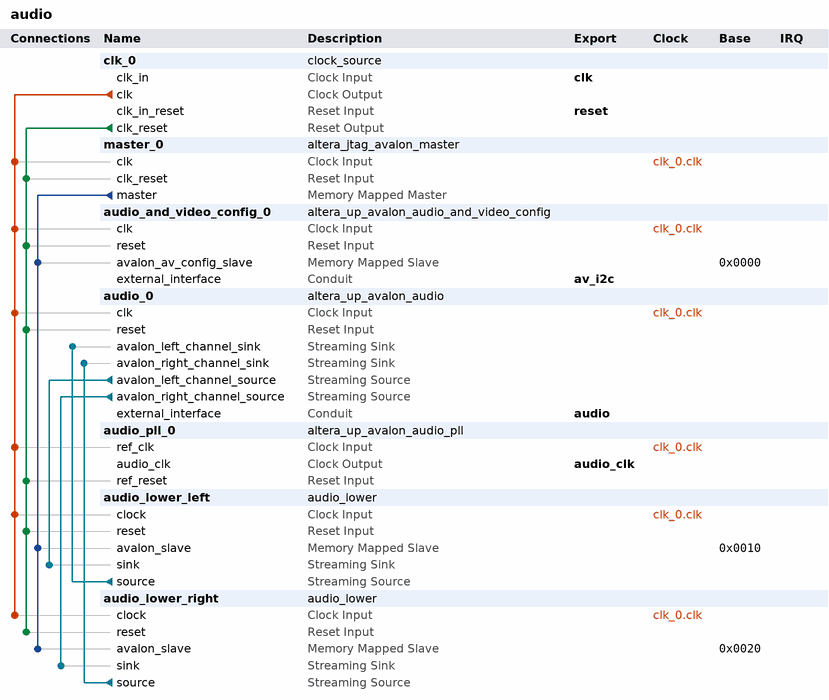
[diagram p0: system contents]
# Platform Designer (Qsys) system audio, Cyclone V 5CSEMA5F31C6
# Parameters at their usual value, and those the tool derives, are not listed.
package require -exact qsys 18.0
create_system audio
set_project_property DEVICE_FAMILY {Cyclone V}
set_project_property DEVICE 5CSEMA5F31C6

add_instance clk_0 clock_source 19.1
set_instance_parameter_value clk_0 clockFrequency 50000000

add_instance master_0 altera_jtag_avalon_master 19.1

add_instance audio_and_video_config_0 altera_up_avalon_audio_and_video_config 18.0
set_instance_parameter_value audio_and_video_config_0 audio_in {Line In to ADC}
set_instance_parameter_value audio_and_video_config_0 bit_length 24
set_instance_parameter_value audio_and_video_config_0 board DE10-Standard
set_instance_parameter_value audio_and_video_config_0 line_in_bypass false
set_instance_parameter_value audio_and_video_config_0 sampling_rate {48 kHz}
set_instance_parameter_value audio_and_video_config_0 video_format PAL

add_instance audio_0 altera_up_avalon_audio 18.0
set_instance_parameter_value audio_0 audio_in true
set_instance_parameter_value audio_0 avalon_bus_type Streaming
set_instance_parameter_value audio_0 dw 24

add_instance audio_pll_0 altera_up_avalon_audio_pll 18.0
set_instance_parameter_value audio_pll_0 gui_refclk 50.0

add_instance audio_lower_left audio_lower 1.0
set_instance_parameter_value audio_lower_left BITS 24

add_instance audio_lower_right audio_lower 1.0
set_instance_parameter_value audio_lower_right BITS 24

# connections
add_connection clk_0.clk audio_0.clk clock
add_connection clk_0.clk audio_and_video_config_0.clk clock
add_connection clk_0.clk audio_lower_left.clock clock
add_connection clk_0.clk audio_lower_right.clock clock
add_connection clk_0.clk audio_pll_0.ref_clk clock
add_connection clk_0.clk master_0.clk clock
add_connection clk_0.clk_reset audio_0.reset reset
add_connection clk_0.clk_reset audio_and_video_config_0.reset reset
add_connection clk_0.clk_reset audio_lower_left.reset reset
add_connection clk_0.clk_reset audio_lower_right.reset reset
add_connection clk_0.clk_reset audio_pll_0.ref_reset reset
add_connection clk_0.clk_reset master_0.clk_reset reset
add_connection master_0.master audio_and_video_config_0.avalon_av_config_slave avalon
set_connection_parameter_value master_0.master/audio_and_video_config_0.avalon_av_config_slave baseAddress 0x0000
add_connection master_0.master audio_lower_left.avalon_slave avalon
set_connection_parameter_value master_0.master/audio_lower_left.avalon_slave baseAddress 0x0010
add_connection master_0.master audio_lower_right.avalon_slave avalon
set_connection_parameter_value master_0.master/audio_lower_right.avalon_slave baseAddress 0x0020
add_connection audio_0.avalon_left_channel_source audio_lower_left.sink avalon_streaming
add_connection audio_0.avalon_right_channel_source audio_lower_right.sink avalon_streaming
add_connection audio_lower_left.source audio_0.avalon_left_channel_sink avalon_streaming
add_connection audio_lower_right.source audio_0.avalon_right_channel_sink avalon_streaming

# exported interfaces
add_interface audio conduit end
set_interface_property audio EXPORT_OF audio_0.external_interface
add_interface audio_clk clock source
set_interface_property audio_clk EXPORT_OF audio_pll_0.audio_clk
add_interface av_i2c conduit end
set_interface_property av_i2c EXPORT_OF audio_and_video_config_0.external_interface
add_interface clk clock sink
set_interface_property clk EXPORT_OF clk_0.clk_in
add_interface reset reset sink
set_interface_property reset EXPORT_OF clk_0.clk_in_reset

set_interconnect_requirement {$system} qsys_mm.clockCrossingAdapter HANDSHAKE
set_interconnect_requirement {$system} qsys_mm.enableEccProtection FALSE
set_interconnect_requirement {$system} qsys_mm.insertDefaultSlave FALSE
set_interconnect_requirement {$system} qsys_mm.maxAdditionalLatency 1

save_system audio.qsys
